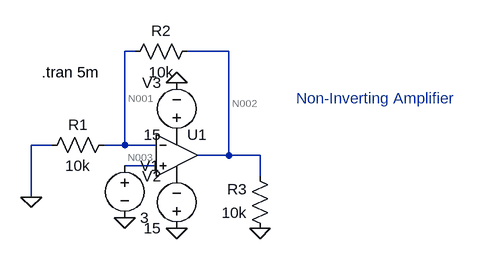
[diagram p0: schematic non inverting amp.asc]
non inverting amp.asc, the LTspice schematic file:
Version 4
SHEET 1 880 680
WIRE 128 16 112 16
WIRE 272 16 208 16
WIRE 0 160 -32 160
WIRE 112 160 112 16
WIRE 112 160 80 160
WIRE 160 160 112 160
WIRE 272 176 272 16
WIRE 272 176 224 176
WIRE 320 176 272 176
WIRE 160 192 112 192
WIRE 320 208 320 176
WIRE -32 240 -32 160
FLAG -32 240 0
FLAG 112 272 0
FLAG 192 288 0
FLAG 320 288 0
FLAG 192 64 0
SYMBOL Opamps\\UniversalOpamp2 192 176 R0
SYMATTR InstName U1
SYMBOL res 96 144 R90
WINDOW 0 0 56 VBottom 2
WINDOW 3 32 56 VTop 2
SYMATTR InstName R1
SYMATTR Value 10k
SYMBOL voltage 112 176 R0
WINDOW 123 0 0 Left 0
WINDOW 39 0 0 Left 0
SYMATTR InstName V1
SYMATTR Value 3
SYMBOL voltage 192 304 R180
WINDOW 0 24 96 Left 2
WINDOW 3 24 16 Left 2
WINDOW 123 0 0 Left 0
WINDOW 39 0 0 Left 0
SYMATTR InstName V2
SYMATTR Value 15
SYMBOL voltage 192 160 R180
WINDOW 0 24 96 Left 2
WINDOW 3 24 16 Left 2
WINDOW 123 0 0 Left 0
WINDOW 39 0 0 Left 0
SYMATTR InstName V3
SYMATTR Value 15
SYMBOL res 224 0 R90
WINDOW 0 0 56 VBottom 2
WINDOW 3 32 56 VTop 2
SYMATTR InstName R2
SYMATTR Value 10k
SYMBOL res 336 304 R180
WINDOW 0 36 76 Left 2
WINDOW 3 36 40 Left 2
SYMATTR InstName R3
SYMATTR Value 10k
TEXT -16 48 Left 2 !.tran 5m
TEXT 376 88 Left 2 ;Non-Inverting Amplifier

The netlist it stands for:
* non inverting amp.asc
XU1 N003 N001 P001 P002 N002 level.2 Avol=1Meg GBW=10Meg Slew=10Meg ilimit=25m rail=0 Vos=0 phimargin=45 en=0 enk=0 in=0 ink=0 Rin=500Meg  ; pins IN+ IN- V+ V- OUT
R1 N001 0 10k
V1 N003 0 3
V2 0 P002 15
V3 P001 0 15
R2 N002 N001 10k
R3 0 N002 10k
.tran 5m
* Non-Inverting Amplifier
.lib UniversalOpamps2.sub
.backanno
.end

* Results of the author's LTspice run, read from the files saved beside the schematic
* Operating Point, zero values left out:
*   V(n002) = 6 V
*   V(p001) = 15 V
*   V(p002) = -15 V
*   V(n001) = 3 V
*   V(n003) = 3 V
*   I(R3) = -600 µA
*   I(R2) = 300 µA
*   I(R1) = 300 µA
*   I(V3) = -1.895 mA
*   I(V2) = -995.1 µA
*   I(V1) = -6 nA
*   Ix(u1:1) = 6 nA
*   Ix(u1:2) = 6 nA
*   Ix(u1:3) = 1.895 mA
*   Ix(u1:4) = -995.1 µA
*   Ix(u1:5) = -900 µA